# Altium schematic sheet TCA_CLK_DIST.SchDoc: My title
size A3; Organization: University of California; Address1: 475 Portola Plaza; Address2: Los Angeles, CA 90095; Revision: R01; SheetNumber: 1; SheetTotal: 1
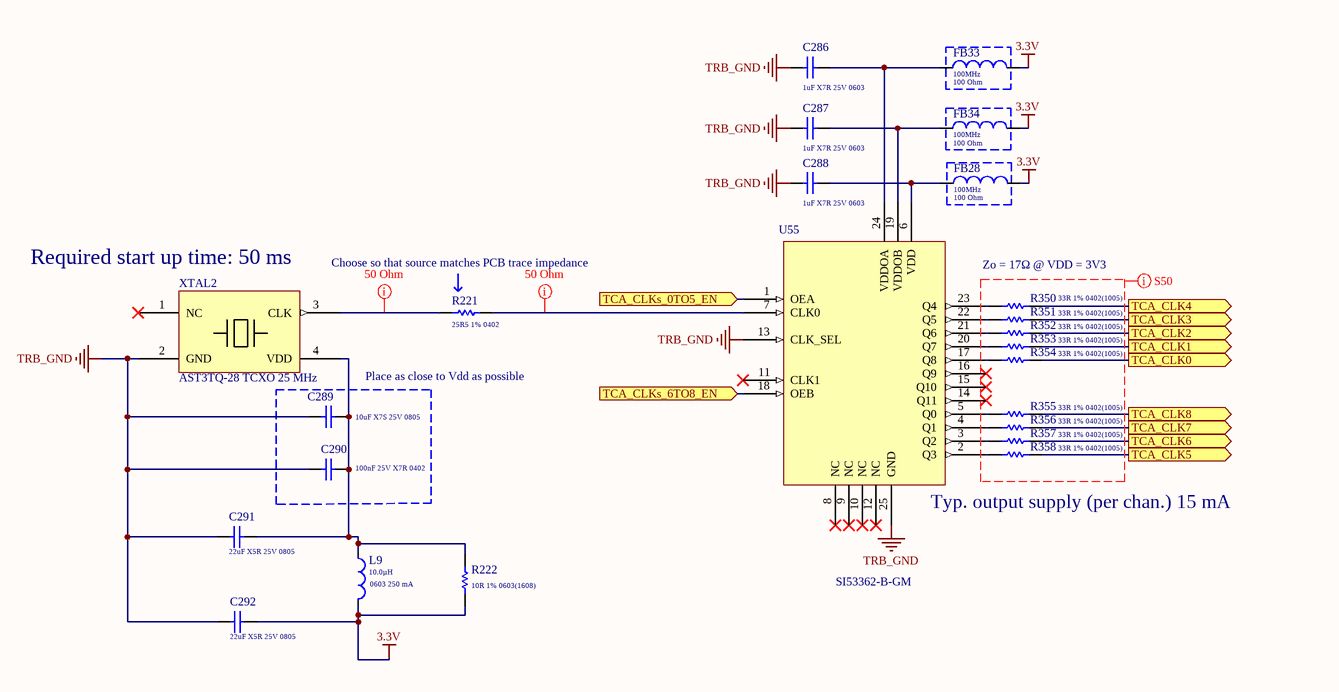
[diagram p0: TCA_CLK_DIST.SchDoc]

## Parts
C286  Capacitance: 1uF X7R 25V 0603  [Cap_Murata_GCJ188R71E105KA01J_1uF]  (hidden comment: Cap_Murata_GCJ188R71E105KA01J_1uF)
C287  Capacitance: 1uF X7R 25V 0603  [Cap_Murata_GCJ188R71E105KA01J_1uF]  (hidden comment: Cap_Murata_GCJ188R71E105KA01J_1uF)
C288  Capacitance: 1uF X7R 25V 0603  [Cap_Murata_GCJ188R71E105KA01J_1uF]  (hidden comment: Cap_Murata_GCJ188R71E105KA01J_1uF)
C289  Capacitance: 10uF X7S 25V 0805  [Cap_Murata_ GRM21BC71E106ME11L_10uF]  (hidden comment: Cap_Murata_ GRM21BC71E106ME11L_10uF)
C290  Capacitance: 100nF 25V X7R 0402  [Cap_Taiyo_Yuden_TMK105B7104KV-FR_100nF]  (hidden comment: Cap_Taiyo_Yuden_TMK105B7104KV-FR_100nF)
C291  Capacitance: 22uF X5R 25V 0805  [Cap_Murata_GRT21BR61E226ME13L_22uF]  (hidden comment: Cap_Murata_GRT21BR61E226ME13L_22uF)
C292  Capacitance: 22uF X5R 25V 0805  [Cap_Murata_GRT21BR61E226ME13L_22uF]  (hidden comment: Cap_Murata_GRT21BR61E226ME13L_22uF)
FB28  Measuring Frequency: 100MHz  Impedance: 100 Ohm  [FB_Wurth_Electronics_742792731_100Ohms]  (hidden comment: 742792731)
FB33  Measuring Frequency: 100MHz  Impedance: 100 Ohm  [FB_Wurth_Electronics_742792731_100Ohms]  (hidden comment: 742792731)
FB34  Measuring Frequency: 100MHz  Impedance: 100 Ohm  [FB_Wurth_Electronics_742792731_100Ohms]  (hidden comment: 742792731)
L9  0603 250 mA  Inductance: 10.0µH  [TDK_MLZ1608M100WT_0]
R221  25R5 1% 0402  [RESC0402(1005)_L]
R222  10R 1% 0603(1608)  [RESC0603(1608)_L]
R350  33R 1% 0402(1005)  [RESC0402(1005)_L]
R351  33R 1% 0402(1005)  [RESC0402(1005)_L]
R352  33R 1% 0402(1005)  [RESC0402(1005)_L]
R353  33R 1% 0402(1005)  [RESC0402(1005)_L]
R354  33R 1% 0402(1005)  [RESC0402(1005)_L]
R355  33R 1% 0402(1005)  [RESC0402(1005)_L]
R356  33R 1% 0402(1005)  [RESC0402(1005)_L]
R357  33R 1% 0402(1005)  [RESC0402(1005)_L]
R358  33R 1% 0402(1005)  [RESC0402(1005)_L]
U55  SI53362-B-GM  [Si53362]
XTAL2  AST3TQ-28 TCXO 25 MHz  [XTAL_ASDM1-25.000MHZ-LC-T]

## Blocks framed on the sheet
Place as close to Vdd as possible: C289 C290

## Ports
TCA_CLK0 (out), TCA_CLK1 (out), TCA_CLK2 (out), TCA_CLK3 (out), TCA_CLK4 (out), TCA_CLK5 (out), TCA_CLK6 (out), TCA_CLK7 (out), TCA_CLK8 (out), TCA_CLKs_0TO5_EN (in), TCA_CLKs_6TO8_EN (in)

## Nets
3.3V: C292.2 FB28.2 FB33.2 FB34.2 L9.2 R222.1
TRB_GND: C286.2 C287.2 C288.2 C289.1 C290.2 C291.1 C292.1 U55.13(CLK_SEL) U55.25(GND) XTAL2.2(GND)
TCA_CLK0: R354.2 ; port TCA_CLK0
TCA_CLK1: R353.2 ; port TCA_CLK1
TCA_CLK2: R352.2 ; port TCA_CLK2
TCA_CLK3: R351.2 ; port TCA_CLK3
TCA_CLK4: R350.2 ; port TCA_CLK4
TCA_CLK5: R358.2 ; port TCA_CLK5
TCA_CLK6: R357.2 ; port TCA_CLK6
TCA_CLK7: R356.2 ; port TCA_CLK7
TCA_CLK8: R355.2 ; port TCA_CLK8
TCA_CLKs_0TO5_EN: U55.1(OEA) ; port TCA_CLKs_0TO5_EN
TCA_CLKs_6TO8_EN: U55.18(OEB) ; port TCA_CLKs_6TO8_EN
NetC286_1: C286.1 FB33.1 U55.24(VDDOA)
NetC287_1: C287.1 FB34.1 U55.19(VDDOB)
NetC288_1: C288.1 FB28.1 U55.6(VDD)
NetC289_2: C289.2 C290.1 C291.2 L9.1 R222.2 XTAL2.4(VDD)
NetR221_1: R221.1 XTAL2.3(CLK)
NetR221_2: R221.2 U55.7(CLK0)
NetR350_1: R350.1 U55.23(Q4)
NetR351_1: R351.1 U55.22(Q5)
NetR352_1: R352.1 U55.21(Q6)
NetR353_1: R353.1 U55.20(Q7)
NetR354_1: R354.1 U55.17(Q8)
NetR355_1: R355.1 U55.5(Q0)
NetR356_1: R356.1 U55.4(Q1)
NetR357_1: R357.1 U55.3(Q2)
NetR358_1: R358.1 U55.2(Q3)

Not connected (* = marked no-connect by the designer): U55 8(NC)* 9(NC)* 10(NC)* 11(CLK1)* 12(NC)* 14(Q11)* 15(Q10)* 16(Q9)*; XTAL2 1(NC)*

## Layout directives
net class S50: (no net found under the mark)

## Notes on the sheet
- (near XTAL2) Required start up time: 50 ms
- Choose so that source matches PCB trace impedance
- Zo = 17Ω @ VDD = 3V3
- (near U55) Typ. output supply (per chan.) 15 mA
- 475 Portola Plaza
- GAPS TOF
- igarcia91@g.ucla.edu
- Los Angeles, CA
- 310-825-0344
- Size:
- Date:
- Letter
- Number:
- Time:
- Sheet
- Revision:
- of
- andrew.peck@cern.ch
- spq@ucla.edu
- File:

## Library data of the parts
C286-C288 = Cap_Murata_GCJ188R71E105KA01J_1uF: CAP CER 1uF 25V X7R 0603; Supplier 1: Mouser; Supplier Part Number 1: 81-GCJ188R71E105KA1J
C289 = Cap_Murata_ GRM21BC71E106ME11L_10uF: CAP CER 10uF 25V X7R 0805; Supplier 1: Mouser; Supplier Part Number 1: 81-GRM21BC71E106ME1L
C290 = Cap_Taiyo_Yuden_TMK105B7104KV-FR_100nF: CAP CER 100nF 25V X7R 0402; Supplier 1: Mouser; Supplier Part Number 1: 963-TMK105B7104KV-FR
C291 C292 = Cap_Murata_GRT21BR61E226ME13L_22uF: CAP CER 22uF 25V X5R 0805; Supplier 1: Mouser; Supplier Part Number 1: 81-GRT21BR61E226ME3L
FB28 FB33 FB34 = FB_Wurth_Electronics_742792731_100Ohms: FB SMD 100 OHM 25% 1.2A 0402; DC Resistance: 90mOhm; Supplier 1: Mouser; Supplier Part Number 1: 710-742792731
L9 = Ind_TDK_MLZ1608M100WT_eec: IND 10µH Shielded Multilayer Inductor 250mA 1.365 Ohm Max 0603 (1608 Metric); Manufacturer: TDK; Value: 10.0µH; Tolerance: ±20%; Part Number: MLZ1608M100WT; helpURL: https://upverter.com/upn/revision/22fa022ced0eb0ec/; ComponentLink2Description: Datasheet; Temperature: -55°C to +125°C; Package: 0603 (1608 metric); Supplier 2: Mouser; Supplier 1: Digi-Key; ComponentLink1URL: https://upverter.com/upn/revision/22fa022ced0eb0ec/; Supplier Part Number 2: 810-MLZ1608M100WT000; Supplier Part Number 1: 445-6389-1-ND; ComponentLink1Description: Upverter; ComponentLink2URL: https://product.tdk.com/info/en/catalog/datasheets/inductor_commercial_decoupling_mlz1608_en.pdf; RoHS: TRUE; Mouser Part Number: 810-MLZ1608M100WT000; Current Rating: 250mA; Ipc Land Pattern Name: CAPC16080X45; Temperature Range High: +125°C; Digikey Description: IND 10µH Shielded Multilayer Inductor 250mA 1.365 Ohm Max 0603 (1608 Metric); Digikey Part Number: 445-6389-1-ND; Lead Free: yes; Temperature Range Low: -55°C; DC Resistance (DCR): 1.365 Ohm Max
R221 = CMP-1011-00328-1: 25R5 0.063W 1% 0402 (1005 Metric)  SMD; Case-EIA: 0402; Case-Metric: 1005; Value: 25.50 Ohm; Tolerance: 1 %; Power: 0.063 W; Technology: SMT
R222 = CMP-1012-00284-1: 10R 0.1W 1% 0603 (1608 Metric)  SMD; Case-Metric: 1608; Case-EIA: 0603; Value: 10.00 Ohm; Tolerance: 1 %; Power: 0.1 W; Technology: SMT
R350-R358 = CMP-1011-00341-1: 33R 0.063W 1% 0402 (1005 Metric)  SMD; Case-Metric: 1005; Value: 33.00 Ohm; Case-EIA: 0402; Tolerance: 1 %; Power: 0.063 W; Technology: SMT
U55 = SI53362-B-GM: Clock Buffer LVCMOS 2:12 buffer (200MHz), 2:1 LVCMOS input max, output enable (QFN24); Supplier 1: Mouser; Supplier Part Number 1: 634-SI53362-B-GM
XTAL2 = AST3TQ-28: TCXO Oscillators 25MHz 3.3Volt LVCMOS 0.280 ppm -40C 85C; Supplier 1: Mouser; Supplier Part Number 1: 815-3TQ-T40-28